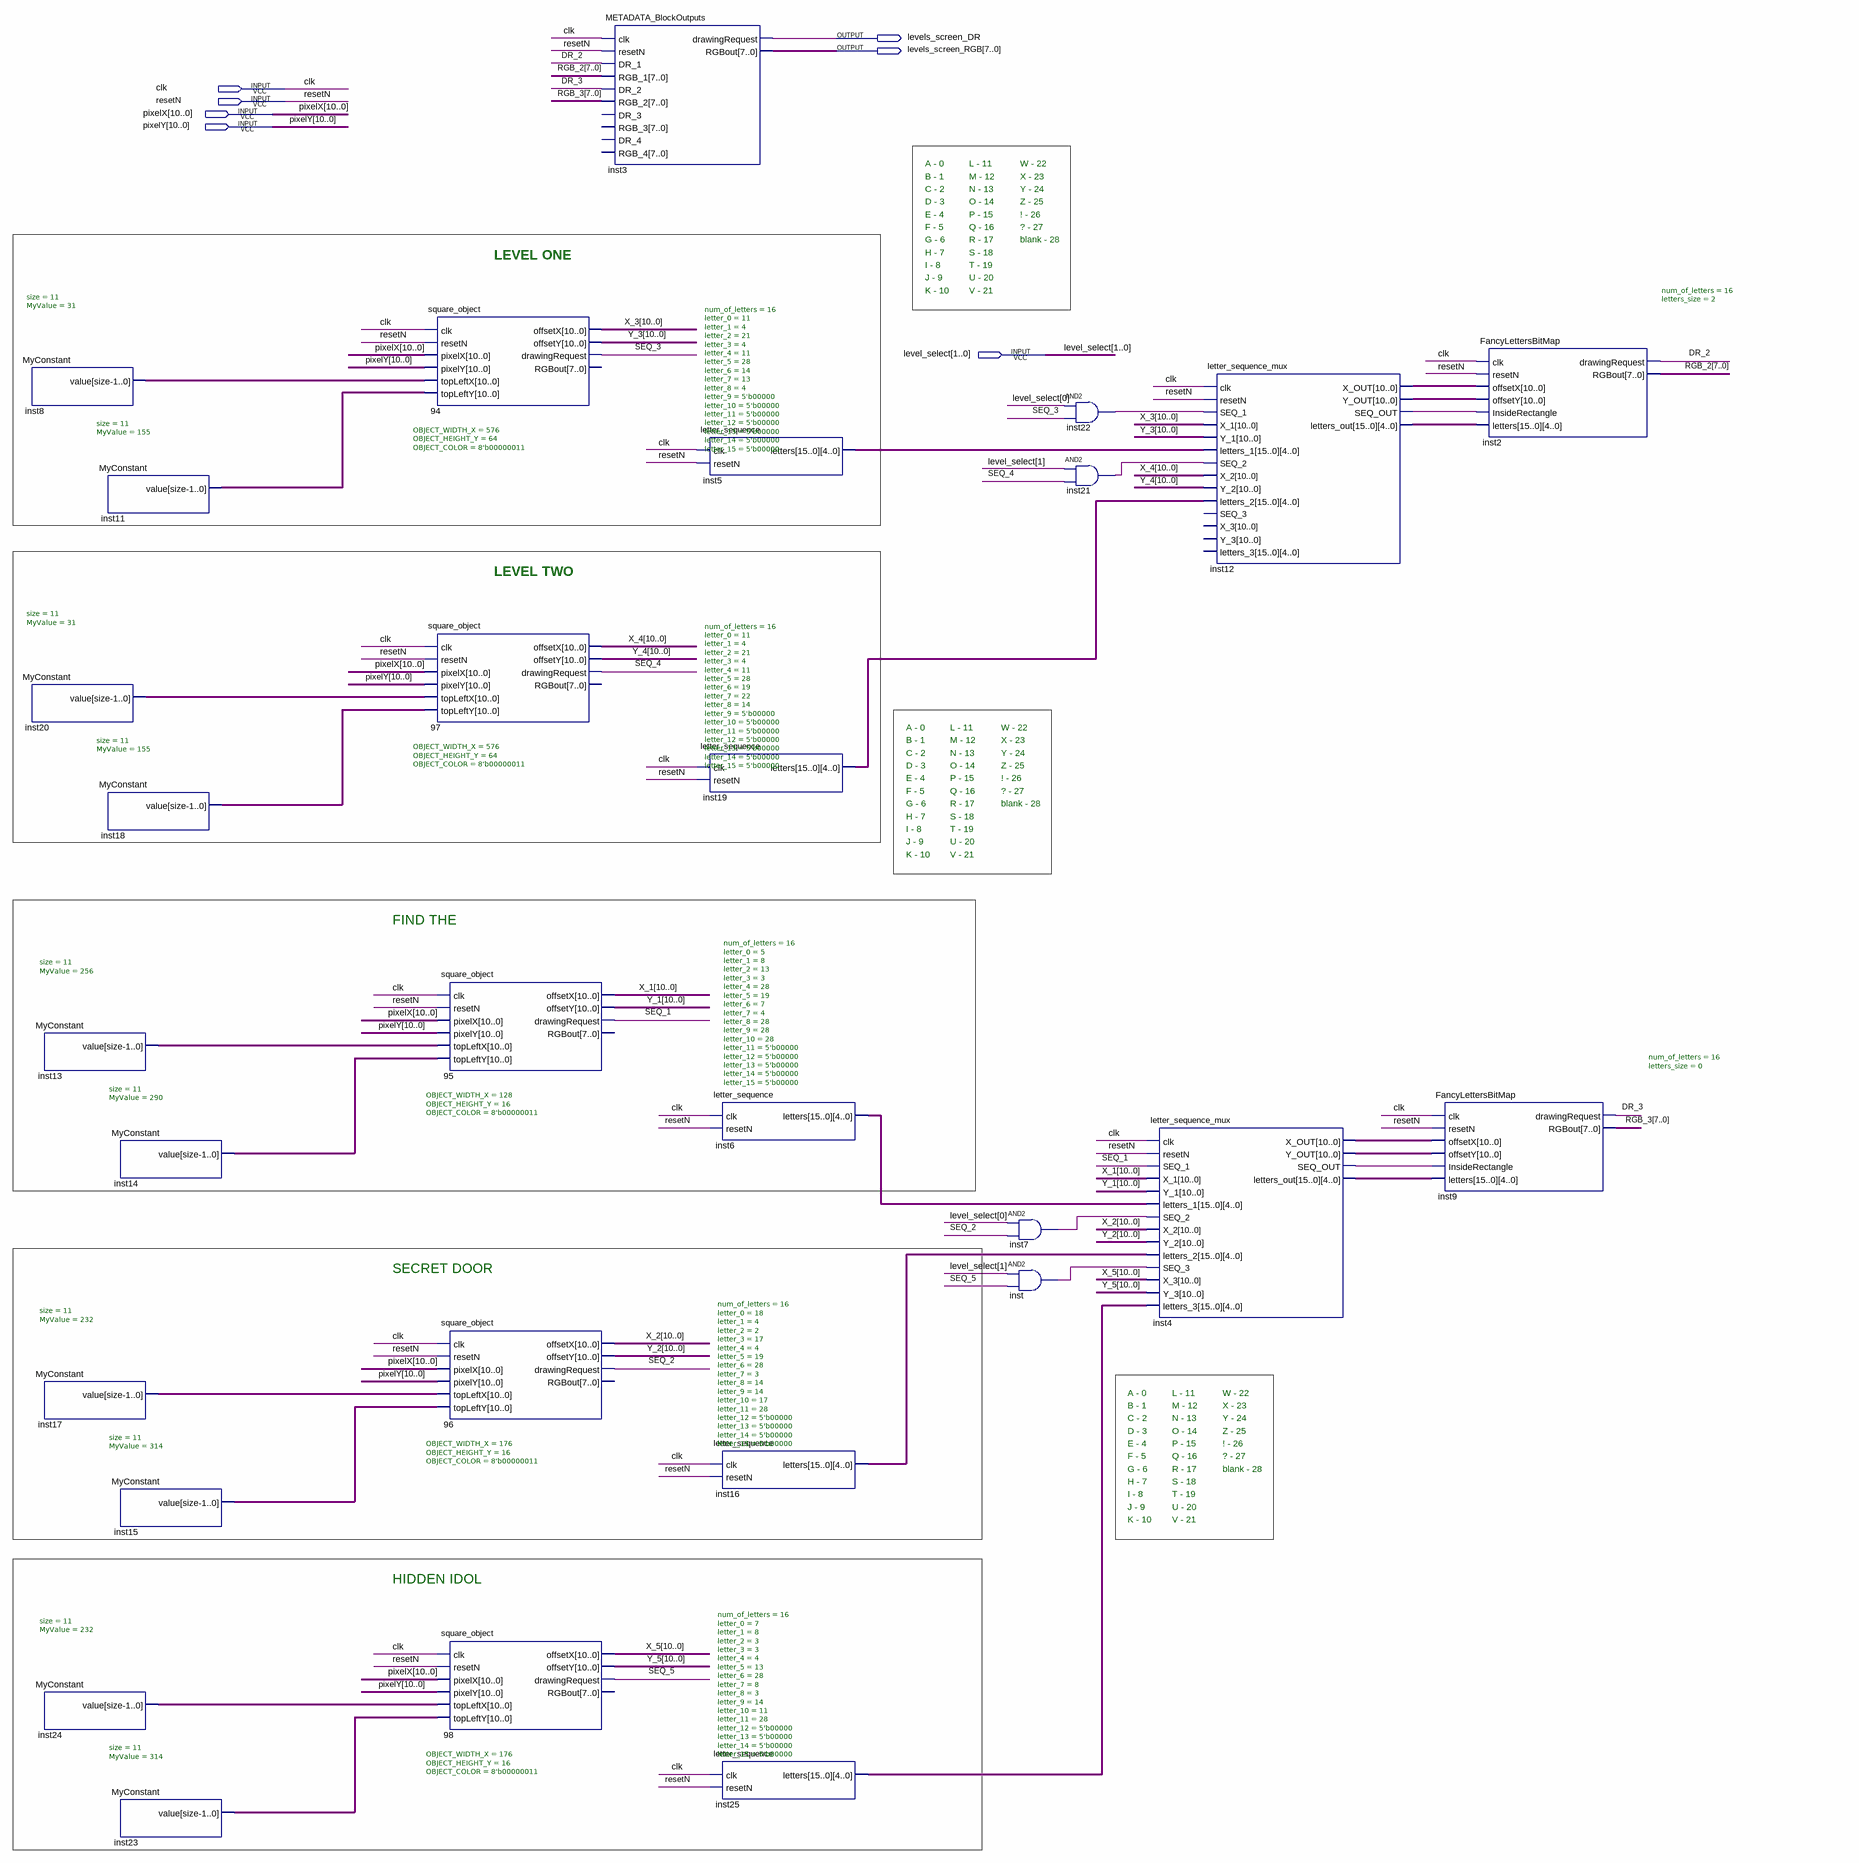
[diagram p0: schematic sheet]
// Quartus schematic Levels_Screen_Block.bdf as structural Verilog: 29 symbols, 7 pins
module Levels_Screen_Block (
  input  clk,
  input  resetN,
  input  [10:0] pixelX,
  input  [10:0] pixelY,
  input  [1:0] level_select,
  output levels_screen_DR,
  output [7:0] levels_screen_RGB
);

  wire DR_2, DR_3, inst4_seq_out, inst7_out, inst12_seq_out, inst21_out, inst22_out, inst_out, SEQ_1, SEQ_2,
       SEQ_3, SEQ_4, SEQ_5;
  wire [7:0] RGB_2, RGB_3;
  wire [10:0] inst4_x_out, inst4_y_out, inst8_value, inst11_value, inst12_x_out, inst12_y_out, inst13_value,
       inst14_value, inst15_value, inst17_value, inst18_value, inst20_value, inst23_value, inst24_value, X_1,
       X_2, X_3, X_4, X_5, Y_1, Y_2, Y_3, Y_4, Y_5;
  wire [79:0] inst4_letters_out, inst5_letters, inst6_letters, inst12_letters_out, inst16_letters,
       inst19_letters, inst25_letters;

  MyConstant #(.size(11), .MyValue(31)) inst8 (.value(inst8_value));
  MyConstant #(.size(11), .MyValue(31)) inst20 (.value(inst20_value));
  MyConstant #(.size(11), .MyValue(256)) inst13 (.value(inst13_value));
  MyConstant #(.size(11), .MyValue(232)) inst17 (.value(inst17_value));
  MyConstant #(.size(11), .MyValue(232)) inst24 (.value(inst24_value));
  MyConstant #(.size(11), .MyValue(155)) inst11 (.value(inst11_value));
  MyConstant #(.size(11), .MyValue(155)) inst18 (.value(inst18_value));
  MyConstant #(.size(11), .MyValue(290)) inst14 (.value(inst14_value));
  MyConstant #(.size(11), .MyValue(314)) inst15 (.value(inst15_value));
  MyConstant #(.size(11), .MyValue(314)) inst23 (.value(inst23_value));
  square_object #(.OBJECT_WIDTH_X(576), .OBJECT_HEIGHT_Y(64), .OBJECT_COLOR(8'b00000011)) u_94 (
    .clk(clk), .resetN(resetN), .pixelX(pixelX), .pixelY(pixelY), .topLeftX(inst8_value),
    .topLeftY(inst11_value), .offsetX(X_3), .offsetY(Y_3), .drawingRequest(SEQ_3));  // open: RGBout
  square_object #(.OBJECT_WIDTH_X(576), .OBJECT_HEIGHT_Y(64), .OBJECT_COLOR(8'b00000011)) u_97 (
    .clk(clk), .resetN(resetN), .pixelX(pixelX), .pixelY(pixelY), .topLeftX(inst20_value),
    .topLeftY(inst18_value), .offsetX(X_4), .offsetY(Y_4), .drawingRequest(SEQ_4));  // open: RGBout
  square_object #(.OBJECT_WIDTH_X(128), .OBJECT_HEIGHT_Y(16), .OBJECT_COLOR(8'b00000011)) u_95 (
    .clk(clk), .resetN(resetN), .pixelX(pixelX), .pixelY(pixelY), .topLeftX(inst13_value),
    .topLeftY(inst14_value), .offsetX(X_1), .offsetY(Y_1), .drawingRequest(SEQ_1));  // open: RGBout
  square_object #(.OBJECT_WIDTH_X(176), .OBJECT_HEIGHT_Y(16), .OBJECT_COLOR(8'b00000011)) u_96 (
    .clk(clk), .resetN(resetN), .pixelX(pixelX), .pixelY(pixelY), .topLeftX(inst17_value),
    .topLeftY(inst15_value), .offsetX(X_2), .offsetY(Y_2), .drawingRequest(SEQ_2));  // open: RGBout
  square_object #(.OBJECT_WIDTH_X(176), .OBJECT_HEIGHT_Y(16), .OBJECT_COLOR(8'b00000011)) u_98 (
    .clk(clk), .resetN(resetN), .pixelX(pixelX), .pixelY(pixelY), .topLeftX(inst24_value),
    .topLeftY(inst23_value), .offsetX(X_5), .offsetY(Y_5), .drawingRequest(SEQ_5));  // open: RGBout
  METADATA_BlockOutputs inst3 (
    .clk(clk), .resetN(resetN), .DR_1(DR_2), .RGB_1(RGB_2), .DR_2(DR_3), .RGB_2(RGB_3),
    .drawingRequest(levels_screen_DR), .RGBout(levels_screen_RGB));  // open: DR_3, RGB_3, DR_4, RGB_4
  letter_sequence #(.num_of_letters(16), .letter_0(11), .letter_1(4), .letter_2(21), .letter_3(4), .letter_4(11), .letter_5(28), .letter_6(14), .letter_7(13), .letter_8(4), .letter_9(5'b00000), .letter_10(5'b00000), .letter_11(5'b00000), .letter_12(5'b00000), .letter_13(5'b00000), .letter_14(5'b00000), .letter_15(5'b00000)) inst5 (
    .clk(clk), .resetN(resetN), .letters(inst5_letters));
  letter_sequence #(.num_of_letters(16), .letter_0(11), .letter_1(4), .letter_2(21), .letter_3(4), .letter_4(11), .letter_5(28), .letter_6(19), .letter_7(22), .letter_8(14), .letter_9(5'b00000), .letter_10(5'b00000), .letter_11(5'b00000), .letter_12(5'b00000), .letter_13(5'b00000), .letter_14(5'b00000), .letter_15(5'b00000)) inst19 (
    .clk(clk), .resetN(resetN), .letters(inst19_letters));
  letter_sequence #(.num_of_letters(16), .letter_0(5), .letter_1(8), .letter_2(13), .letter_3(3), .letter_4(28), .letter_5(19), .letter_6(7), .letter_7(4), .letter_8(28), .letter_9(28), .letter_10(28), .letter_11(5'b00000), .letter_12(5'b00000), .letter_13(5'b00000), .letter_14(5'b00000), .letter_15(5'b00000)) inst6 (
    .clk(clk), .resetN(resetN), .letters(inst6_letters));
  letter_sequence #(.num_of_letters(16), .letter_0(18), .letter_1(4), .letter_2(2), .letter_3(17), .letter_4(4), .letter_5(19), .letter_6(28), .letter_7(3), .letter_8(14), .letter_9(14), .letter_10(17), .letter_11(28), .letter_12(5'b00000), .letter_13(5'b00000), .letter_14(5'b00000), .letter_15(5'b00000)) inst16 (
    .clk(clk), .resetN(resetN), .letters(inst16_letters));
  letter_sequence #(.num_of_letters(16), .letter_0(7), .letter_1(8), .letter_2(3), .letter_3(3), .letter_4(4), .letter_5(13), .letter_6(28), .letter_7(8), .letter_8(3), .letter_9(14), .letter_10(11), .letter_11(28), .letter_12(5'b00000), .letter_13(5'b00000), .letter_14(5'b00000), .letter_15(5'b00000)) inst25 (
    .clk(clk), .resetN(resetN), .letters(inst25_letters));
  and inst7 (inst7_out, level_select[0], SEQ_2);
  and inst (inst_out, level_select[1], SEQ_5);
  and inst22 (inst22_out, level_select[0], SEQ_3);
  and inst21 (inst21_out, level_select[1], SEQ_4);
  letter_sequence_mux inst4 (
    .clk(clk), .resetN(resetN), .SEQ_1(SEQ_1), .X_1(X_1), .Y_1(Y_1), .letters_1(inst6_letters),
    .SEQ_2(inst7_out), .X_2(X_2), .Y_2(Y_2), .letters_2(inst16_letters), .SEQ_3(inst_out), .X_3(X_5),
    .Y_3(Y_5), .letters_3(inst25_letters), .X_OUT(inst4_x_out), .Y_OUT(inst4_y_out), .SEQ_OUT(inst4_seq_out),
    .letters_out(inst4_letters_out));
  letter_sequence_mux inst12 (
    .clk(clk), .resetN(resetN), .SEQ_1(inst22_out), .X_1(X_3), .Y_1(Y_3), .letters_1(inst5_letters),
    .SEQ_2(inst21_out), .X_2(X_4), .Y_2(Y_4), .letters_2(inst19_letters), .X_OUT(inst12_x_out),
    .Y_OUT(inst12_y_out), .SEQ_OUT(inst12_seq_out), .letters_out(inst12_letters_out));  // open: SEQ_3, X_3, Y_3, letters_3
  FancyLettersBitMap #(.num_of_letters(16), .letters_size(0)) inst9 (
    .clk(clk), .resetN(resetN), .offsetX(inst4_x_out), .offsetY(inst4_y_out),
    .InsideRectangle(inst4_seq_out), .letters(inst4_letters_out), .drawingRequest(DR_3), .RGBout(RGB_3));
  FancyLettersBitMap #(.num_of_letters(16), .letters_size(2)) inst2 (
    .clk(clk), .resetN(resetN), .offsetX(inst12_x_out), .offsetY(inst12_y_out),
    .InsideRectangle(inst12_seq_out), .letters(inst12_letters_out), .drawingRequest(DR_2), .RGBout(RGB_2));

  // Notes on the sheet:
  //   A - 0
  //   L - 11
  //   W - 22
  //   B - 1
  //   M - 12
  //   X - 23
  //   C - 2
  //   N - 13
  //   Y - 24
  //   D - 3
  //   O - 14
  //   Z - 25
  //   E - 4
  //   P - 15
  //   ! - 26
  //   F - 5
  //   Q - 16
  //   ? - 27
  //   G - 6
  //   R - 17
  //   blank - 28
  //   LEVEL ONE
  //   H - 7
  //   S - 18
  //   I - 8
  //   T - 19
  //   J - 9
  //   U - 20
  //   K - 10
  //   V - 21
  //   LEVEL TWO
  //   A - 0
  //   L - 11
  //   W - 22
  //   B - 1
  //   M - 12
  //   X - 23
  //   C - 2
  //   N - 13
  //   Y - 24
  //   D - 3
  //   O - 14
  //   Z - 25
  //   E - 4
  //   P - 15
  //   ! - 26
  //   F - 5
  //   Q - 16
  //   ? - 27
  //   G - 6
  //   R - 17
  //   blank - 28
  //   H - 7
  //   S - 18
  //   I - 8
  //   T - 19
  //   J - 9
  //   U - 20
  //   K - 10
  //   V - 21
  //   FIND THE
  //   SECRET DOOR
  //   A - 0
  //   L - 11
  //   W - 22
  //   B - 1
  //   M - 12
  //   X - 23
  //   C - 2
  //   N - 13
  //   Y - 24
  //   D - 3
  //   O - 14
  //   Z - 25
  //   E - 4
  //   P - 15
  //   ! - 26
  //   F - 5
  //   Q - 16
  //   ? - 27
  //   G - 6
  //   R - 17
  //   blank - 28
  //   H - 7
  //   S - 18
  //   I - 8
  //   T - 19
  //   J - 9
  //   U - 20
  //   K - 10
  //   V - 21
  //   HIDDEN IDOL
endmodule
